# Altium schematic sheet Sheet2.SchDoc
size A4
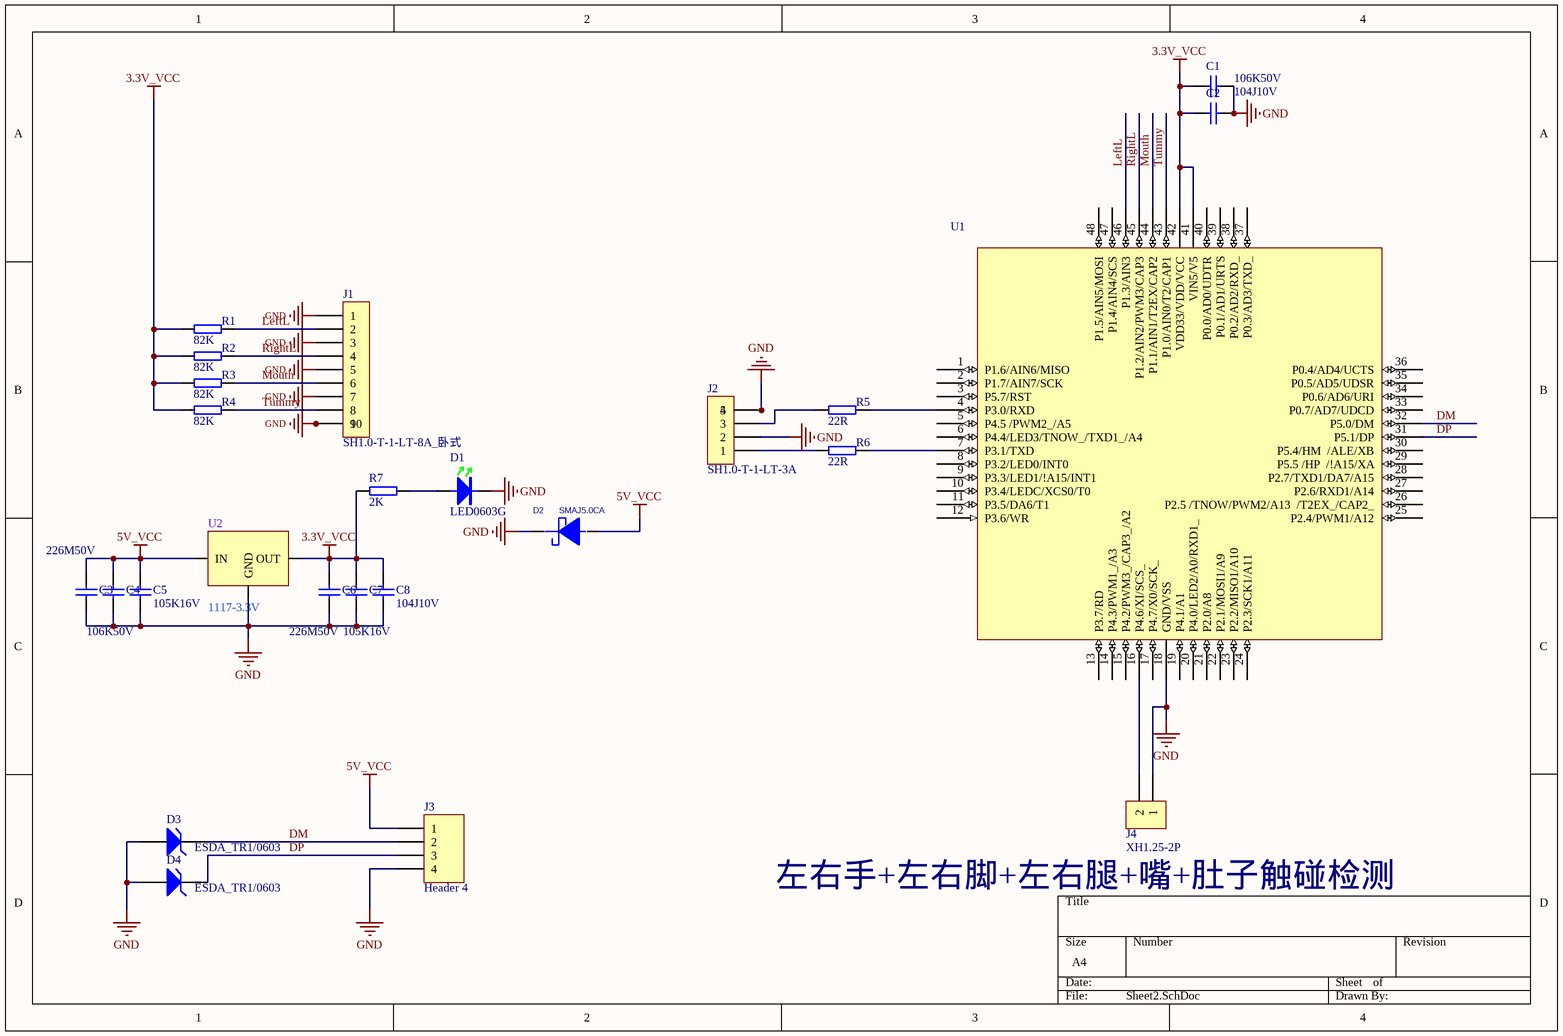
[diagram p0: Sheet2.SchDoc]

## Parts
C1  106K50V  [C0603]
C2  104J10V  [C0402]
C3  226M50V  [C0805]
C4  106K50V  [C0603]
C5  105K16V  [C0603]
C6  226M50V  [C0805]
C7  105K16V  [C0603]
C8  104J10V  [C0402]
D1  LED0603G  [D-LED0603G]
D2  SMAJ5.0CA  [DO-214]
D3  ESDA_TR1/0603  [HS_0603D]
D4  ESDA_TR1/0603  [HS_0603D]
J1  SH1.0-T-1-LT-8A_卧式  [J-SH1.0-T-1-LT-8A_卧式]
J2  SH1.0-T-1-LT-3A  [J-SH1.0-T-1-LT-3A]
J3  Header 4  [USB-AB]
J4  XH1.25-2P  [S1.25-2P]
R1  82K  [R0603]
R2  82K  [R0603]
R3  82K  [R0603]
R4  82K  [R0603]
R5  22R  [R0603]
R6  22R  [R0603]
R7  2K  [R0603]
U1  CH559L  [LQFP48]  (value not drawn)
U2  1117-3.3V  [SOT-223]

## Nets
3.3V_VCC: C1.2 C2.2 C6.1 C7.2 C8.1 R1.1 R2.1 R3.1 R4.1 R7.2 U1.41(VIN5/V5) U1.42(VDD33/VDD/VCC) U2.2(OUT)
5V_VCC: C3.1 C4.1 C5.1 D2.1(+) J3.1 U2.3(IN)
GND: C1.1 C2.1 C3.2 C4.2 C5.2 C6.2 C7.1 C8.2 D1.2 D2.2(-) D3.1(A) D4.1(A) J1.1 J1.3 J1.5 J1.7 J1.9 J1.10 J2.2 J2.4 J2.5 J3.4 J4.1 U1.18(GND/VSS) U2.1(GND)
DM: D3.2(K) J3.2 U1.32(P5.0/DM)
DP: D4.2(K) J3.3 U1.31(P5.1/DP)
LeftL: J1.2 R1.2 U1.46(P1.3/AIN3)
Mouth: J1.6 R3.2 U1.44(P1.1/AIN1/T2EX/CAP2)
RightL: J1.4 R2.2 U1.45(P1.2/AIN2/PWM3/CAP3)
Tummy: J1.8 R4.2 U1.43(P1.0/AIN0/T2/CAP1)
NetD1_1: D1.1 R7.1
NetJ2_1: J2.1 R6.1
NetJ2_3: J2.3 R5.1
NetJ4_2: J4.2 U1.16(P4.6/XI/SCS_)
NetR5_2: R5.2 U1.4(P3.0/RXD)
NetR6_2: R6.2 U1.7(P3.1/TXD)

Not connected (* = marked no-connect by the designer): U1 1(P1.6/AIN6/MISO) 2(P1.7/AIN7/SCK) 3(P5.7/RST) 5(P4.5_/PWM2_/A5) 6(P4.4/LED3/TNOW_/TXD1_/A4) 8(P3.2/LED0/INT0) 9(P3.3/LED1/!A15/INT1) 10(P3.4/LEDC/XCS0/T0) 11(P3.5/DA6/T1) 12(P3.6/WR) 13(P3.7/RD) 14(P4.3/PWM1_/A3) 15(P4.2/PWM3_/CAP3_/A2) 17(P4.7/X0/SCK_) 19(P4.1/A1) 20(P4.0/LED2/A0/RXD1_) 21(P2.0/A8) 22(P2.1/MOSI1/A9) 23(P2.2/MISO1/A10) 24(P2.3/SCK1/A11) 25(P2.4/PWM1/A12) 26(P2.5_/TNOW/PWM2/A13__/T2EX_/CAP2_) 27(P2.6/RXD1/A14) 28(P2.7/TXD1/DA7/A15) 29(P5.5_/HP__/!A15/XA) 30(P5.4/HM__/ALE/XB) 33(P0.7/AD7/UDCD) 34(P0.6/AD6/URI) 35(P0.5/AD5/UDSR) 36(P0.4/AD4/UCTS) 37(P0.3/AD3/TXD_) 38(P0.2/AD2/RXD_) 39(P0.1/AD1/URTS) 40(P0.0/AD0/UDTR) 47(P1.4/AIN4/SCS) 48(P1.5/AIN5/MOSI)

## Notes on the sheet
- 左右手+左右脚+左右腿+嘴+肚子触碰检测

## Library data of the parts
C1 C4 = C0603X7R-106K50V: 贴片电容-陶瓷; 规格型号: 10uF±10%_50V_X7R_C0603; 生产商: 风华 三星; 供应商: *; 备注: *
C2 C8 = C0402X7R-104J10V: 贴片电容-陶瓷; 规格型号: 100nF±5%_10V_X7R_C0402; 生产商: 风华 三星; 供应商: *; 备注: *
C3 C6 = C0805Y5V-226M50V: 贴片电容-陶瓷; 规格型号: 22uF±20%_50V_Y5V_C0805; 生产商: 风华 三星; 供应商: *; 备注: *
C5 C7 = C0603X7R-105K16V: 贴片电容-陶瓷; 规格型号: 1uF±10%_16V_X7R_C0603; 生产商: 风华 三星; 供应商: *; 备注: *
D1 = DLED-0603-G: 贴片二极管-LED; 规格型号: 0603-GREEN; 货品编码: 无样品无编码; 生产商: *; 供应商: *; 备注: *
D3 D4 = D Zener: Zener Diode; Published: *; LatestRevisionDate: *; LatestRevisionNote: *; PackageReference: *; Publisher: *
J1 = SH1.0-T-1-LT-8A_卧式: SH1.0-T-1-LT-6A_卧式
J2 = SH1.0-T-1-LT-3A: 接插件-SH1.0-T-1-LT-3A; 规格型号: 1.0m立式贴片插座3P/SH1.0-T-1-LT-3A; 供应商: *; 备注: *
J3 = Header 4: Header, 4-Pin; LatestRevisionDate: 17-Jul-2002; LatestRevisionNote: Re-released for DXP Platform.; Publisher: Altium Limited
J4 = J-XH2.54-2P: 接插件-2.54; 货品编码: 371007; 供应商: *; 规格型号: XH2.54-2P; 备注: *
R1-R7 = R0603-100RF: 贴片电阻-通用; 生产商: 厚声 国巨; 规格型号: 100R±1%_1/10W_±200ppm_R0603; 备注: *; 供应商: *
U1 = CH559L: 单片机
U2 = AP1117-33 SOT-223: 芯片 电源类; 单价: 0.15
D2 = SMAJ5.0CA: PCB DECAL: DO-214; Value: SMAJ5.0CA